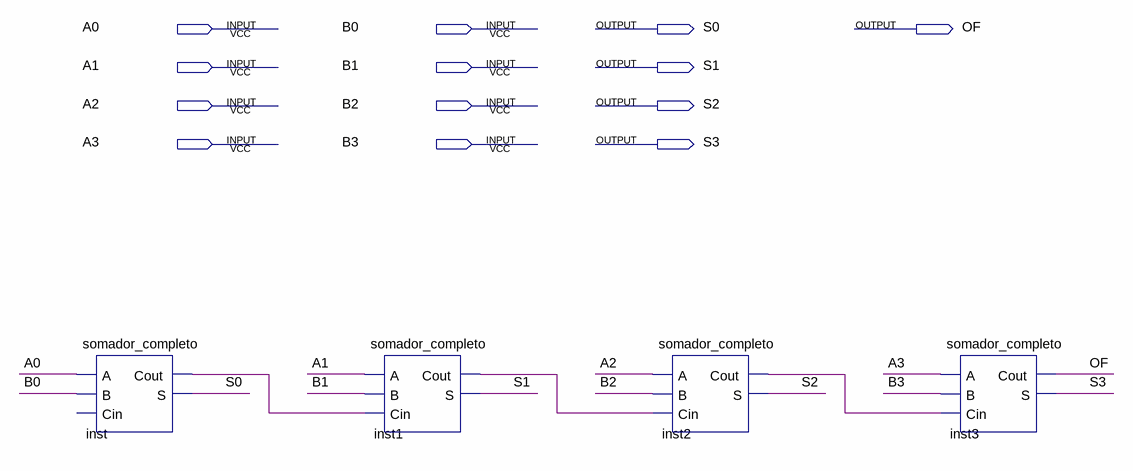
[diagram p0: schematic sheet]
// Quartus schematic bloco_somador.bdf as structural Verilog: 4 symbols, 13 pins
module bloco_somador (
  input  A0,
  input  B0,
  input  A1,
  input  B1,
  input  A2,
  input  B2,
  input  A3,
  input  B3,
  output S0,
  output OF,
  output S1,
  output S2,
  output S3
);

  wire inst1_cout, inst2_cout, inst_cout;

  somador_completo inst (.A(A0), .B(B0), .Cout(inst_cout), .S(S0));  // open: Cin
  somador_completo inst1 (.A(A1), .B(B1), .Cin(inst_cout), .Cout(inst1_cout), .S(S1));
  somador_completo inst2 (.A(A2), .B(B2), .Cin(inst1_cout), .Cout(inst2_cout), .S(S2));
  somador_completo inst3 (.A(A3), .B(B3), .Cin(inst2_cout), .Cout(OF), .S(S3));
endmodule
